# Altium project ANE_0002_02AA.PrjPCB
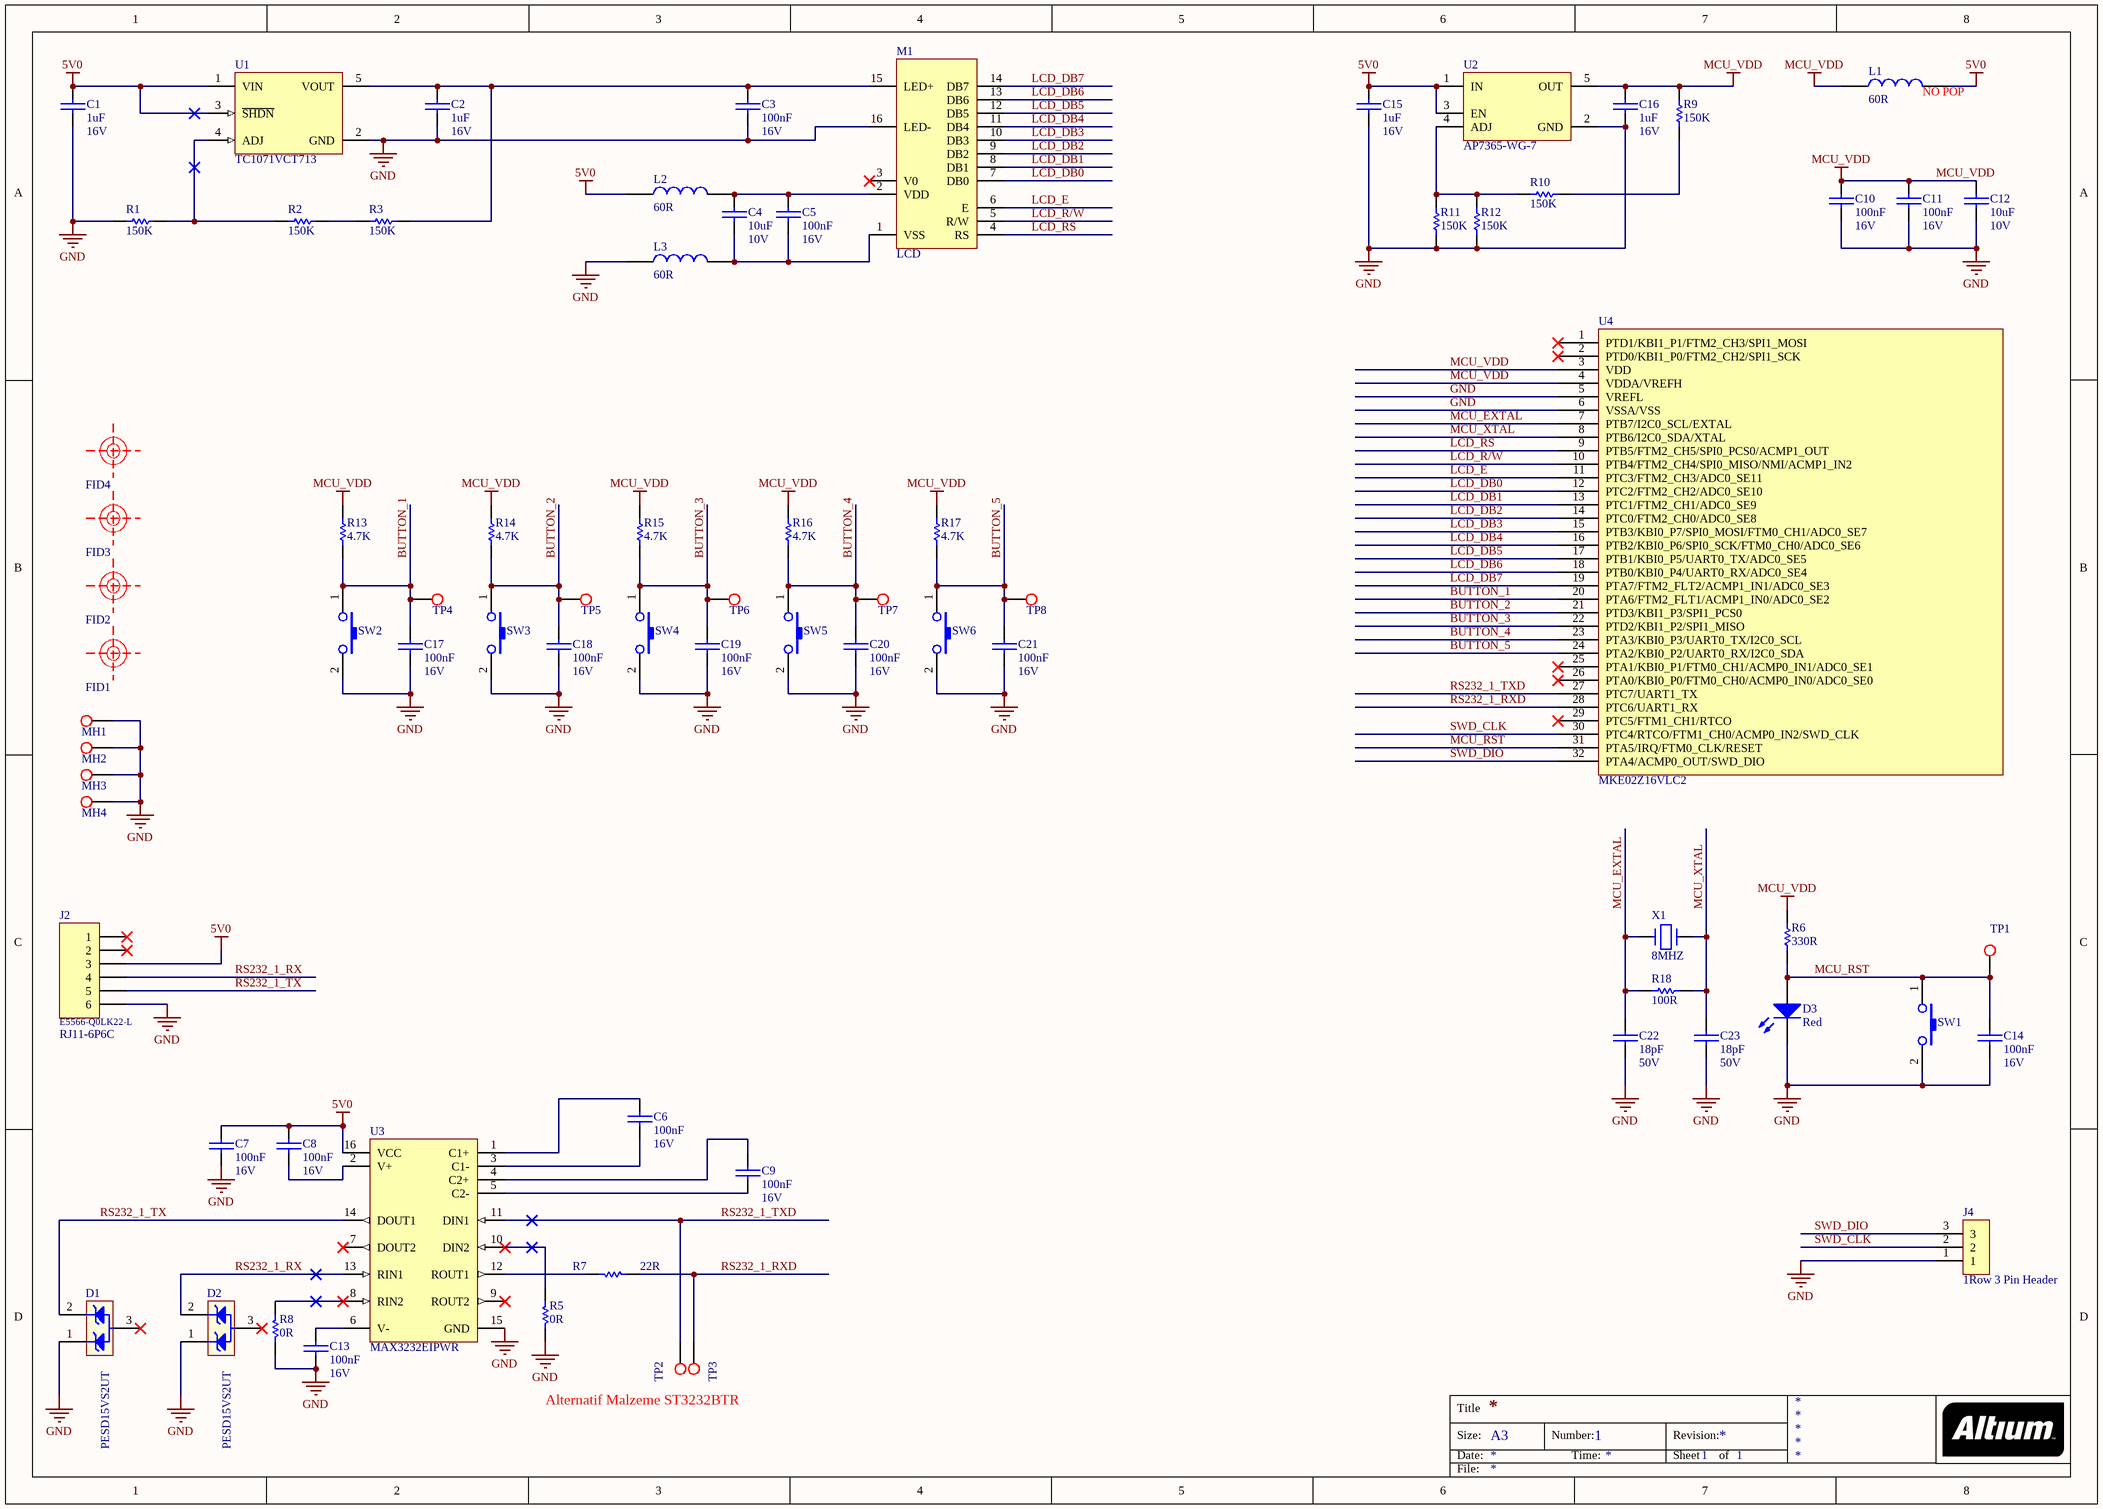
[diagram p0: Main.SchDoc]
ArtronProjeNumarasi: AB00-0006-01AC-0000; Bolum: Artron/Donaným; DegisiklikNumarasi: AC; DegistirmeTarihi: 21.01.2014; GizlilikSinifi: HÝZMETE ÖZEL; KullanilanDil: TR; OlusturmaTarihi: 08.11.2013; Ortam: Altium Designer 13.2.5; PCBDegisiklikTarihi: 20.09.2013
1 sheet, 76 parts. Net scope: hierarchical (ports join the sheet entries above them; power ports are global).
Board file: ANE_0002_02AA_0000.PcbDoc

## Sheet Main.SchDoc
size A3; DocumentNumber: 1; SheetNumber: 1; SheetTotal: 1

### Parts
C1  Operating Voltage: 16V  [CAPC2012X14N]  (hidden comment: 1uF)
C2  Operating Voltage: 16V  [CAPC2012X14N]  (hidden comment: 1uF)
C3  Operating Voltage: 16V  [CAPC1005X06N]  (hidden comment: 100nF)
C4  Operating Voltage: 10V  [CAPC2012X09N]  (hidden comment: 10uF)
C5  Operating Voltage: 16V  [CAPC1005X06N]  (hidden comment: 100nF)
C6  Operating Voltage: 16V  [CAPC1005X06N]  (hidden comment: 100nF)
C7  Operating Voltage: 16V  [CAPC1005X06N]  (hidden comment: 100nF)
C8  Operating Voltage: 16V  [CAPC1005X06N]  (hidden comment: 100nF)
C9  Operating Voltage: 16V  [CAPC1005X06N]  (hidden comment: 100nF)
C10  Operating Voltage: 16V  [CAPC1005X06N]  (hidden comment: 100nF)
C11  Operating Voltage: 16V  [CAPC1005X06N]  (hidden comment: 100nF)
C12  Operating Voltage: 10V  [CAPC2012X09N]  (hidden comment: 10uF)
C13  Operating Voltage: 16V  [CAPC1005X06N]  (hidden comment: 100nF)
C14  Operating Voltage: 16V  [CAPC1005X06N]  (hidden comment: 100nF)
C15  Operating Voltage: 16V  [CAPC2012X14N]  (hidden comment: 1uF)
C16  Operating Voltage: 16V  [CAPC2012X14N]  (hidden comment: 1uF)
C17  Operating Voltage: 16V  [CAPC1005X06N]  (hidden comment: 100nF)
C18  Operating Voltage: 16V  [CAPC1005X06N]  (hidden comment: 100nF)
C19  Operating Voltage: 16V  [CAPC1005X06N]  (hidden comment: 100nF)
C20  Operating Voltage: 16V  [CAPC1005X06N]  (hidden comment: 100nF)
C21  Operating Voltage: 16V  [CAPC1005X06N]  (hidden comment: 100nF)
C22  Operating Voltage: 50V  [CAPC1005X06N]  (hidden comment: 18pF)
C23  Operating Voltage: 50V  [CAPC1005X06N]  (hidden comment: 18pF)
D1  PESD15VS2UT  [SOT95P230X111-3N]
D2  PESD15VS2UT  [SOT95P230X111-3N]
D3  Red  [LEDSC16X08X08-2N]
FID1  Fiducial  [FIDUCIAL_R1MM0]  (value not drawn)
FID2  Fiducial  [FIDUCIAL_R1MM0]  (value not drawn)
FID3  Fiducial  [FIDUCIAL_R1MM0]  (value not drawn)
FID4  Fiducial  [FIDUCIAL_R1MM0]  (value not drawn)
J2  Manufacturer Part Number: E5566-Q0LK22-L  [AJ31-1006-TKSR-RPU0]  (hidden comment: RJ11-6P6C)
J4  1Row 3 Pin Header  [AJ23-1003-T8P0-VFC0]
L1  60R  Assembly: NO POP  [INDC2012X10N]
L2  60R  [INDC2012X10N]
L3  60R  [INDC2012X10N]
M1  LCD  [AME0_GLCD_1432_0000]
MH1  AEMT-C00S-1000-0000  [TP100]  (value not drawn)
MH2  AEMT-C00S-1000-0000  [TP100]  (value not drawn)
MH3  AEMT-C00S-1000-0000  [TP100]  (value not drawn)
MH4  AEMT-C00S-1000-0000  [TP100]  (value not drawn)
R1  150K  [RESC1005X04N]
R2  150K  [RESC1005X04N]
R3  150K  [RESC1005X04N]
R5  0R  [RESC1005X04N]
R6  330R  [RESC1005X04N]
R7  22R  [RESC1005X04N]
R8  0R  [RESC1005X04N]
R9  150K  [RESC1005X04N]
R10  150K  [RESC1005X04N]
R11  150K  [RESC1005X04N]
R12  150K  [RESC1005X04N]
R13  4.7K  [RESC1005X04N]
R14  4.7K  [RESC1005X04N]
R15  4.7K  [RESC1005X04N]
R16  4.7K  [RESC1005X04N]
R17  4.7K  [RESC1005X04N]
R18  100R  [RESC1005X04N]
SW1  Push Button  [AE22-010S-0000-0000]  (value not drawn)
SW2  Push Button  [AE22-010S-0000-0000]  (value not drawn)
SW3  Push Button  [AE22-010S-0000-0000]  (value not drawn)
SW4  Push Button  [AE22-010S-0000-0000]  (value not drawn)
SW5  Push Button  [AE22-010S-0000-0000]  (value not drawn)
SW6  Push Button  [AE22-010S-0000-0000]  (value not drawn)
TP1  AEMT-C00S-1000-0000  [TP100]  (value not drawn)
TP2  AEMT-C00S-1000-0000  [TP100]  (value not drawn)
TP3  AEMT-C00S-1000-0000  [TP100]  (value not drawn)
TP4  AEMT-C00S-1000-0000  [TP100]  (value not drawn)
TP5  AEMT-C00S-1000-0000  [TP100]  (value not drawn)
TP6  AEMT-C00S-1000-0000  [TP100]  (value not drawn)
TP7  AEMT-C00S-1000-0000  [TP100]  (value not drawn)
TP8  AEMT-C00S-1000-0000  [TP100]  (value not drawn)
U1  TC1071VCT713  [SOT-23-CT5_N]
U2  AP7365-WG-7  [SOT95P285X110-5N]
U3  MAX3232EIPWR  [TSOP65P640X120-16N]
U4  MKE02Z16VLC2  [TQFP80P900X900X160-32N]
X1  8MHZ  [XTAL50X32X13]

### Nets
5V0: C1.2 C7.2 C8.2 C15.2 J2.3 L1.2 L2.1 U1.1(VIN) U1.3(~{SHDN}) U2.1(IN) U2.3(EN) U3.16(VCC)
GND: C1.1 C2.1 C3.1 C7.1 C10.1 C11.1 C12.1 C13.1 C14.1 C15.1 C16.1 C17.1 C18.1 C19.1 C20.1 C21.1 C22.2 C23.2 D1.1 D2.1 D3.1(K) J2.6 J4.1 L3.1 M1.16(LED-) MH1.1 MH2.1 MH3.1 MH4.1 R1.2 R5.2 R8.2 R11.1 R12.1 SW1.2 SW2.2 SW3.2 SW4.2 SW5.2 SW6.2 U1.2(GND) U2.2(GND) U3.15(GND) U4.5(VREFL) U4.6(VSSA/VSS)
MCU_VDD: C10.2 C11.2 C12.2 C16.2 L1.1 R6.2 R9.1 R13.2 R14.2 R15.2 R16.2 R17.2 U2.5(OUT) U4.3(VDD) U4.4(VDDA/VREFH)
BUTTON_1: C17.2 R13.1 SW2.1 TP4.1 U4.20(PTA6/FTM2_FLT1/ACMP1_IN0/ADC0_SE2)
BUTTON_2: C18.2 R14.1 SW3.1 TP5.1 U4.21(PTD3/KBI1_P3/SPI1_PCS0)
BUTTON_3: C19.2 R15.1 SW4.1 TP6.1 U4.22(PTD2/KBI1_P2/SPI1_MISO)
BUTTON_4: C20.2 R16.1 SW5.1 TP7.1 U4.23(PTA3/KBI0_P3/UART0_TX/I2C0_SCL)
BUTTON_5: C21.2 R17.1 SW6.1 TP8.1 U4.24(PTA2/KBI0_P2/UART0_RX/I2C0_SDA)
LCD_DB0: M1.7(DB0) U4.12(PTC2/FTM2_CH2/ADC0_SE10)
LCD_DB1: M1.8(DB1) U4.13(PTC1/FTM2_CH1/ADC0_SE9)
LCD_DB2: M1.9(DB2) U4.14(PTC0/FTM2_CH0/ADC0_SE8)
LCD_DB3: M1.10(DB3) U4.15(PTB3/KBI0_P7/SPI0_MOSI/FTM0_CH1/ADC0_SE7)
LCD_DB4: M1.11(DB4) U4.16(PTB2/KBI0_P6/SPI0_SCK/FTM0_CH0/ADC0_SE6)
LCD_DB5: M1.12(DB5) U4.17(PTB1/KBI0_P5/UART0_TX/ADC0_SE5)
LCD_DB6: M1.13(DB6) U4.18(PTB0/KBI0_P4/UART0_RX/ADC0_SE4)
LCD_DB7: M1.14(DB7) U4.19(PTA7/FTM2_FLT2/ACMP1_IN1/ADC0_SE3)
LCD_E: M1.6(E) U4.11(PTC3/FTM2_CH3/ADC0_SE11)
LCD_R/W: M1.5(R/W) U4.10(PTB4/FTM2_CH4/SPI0_MISO/NMI/ACMP1_IN2)
LCD_RS: M1.4(RS) U4.9(PTB5/FTM2_CH5/SPI0_PCS0/ACMP1_OUT)
MCU_EXTAL: C22.1 R18.1 U4.7(PTB7/I2C0_SCL/EXTAL) X1.1
MCU_RST: C14.2 D3.2(A) R6.1 SW1.1 TP1.1 U4.31(PTA5/IRQ/FTM0_CLK/RESET)
MCU_XTAL: C23.1 R18.2 U4.8(PTB6/I2C0_SDA/XTAL) X1.2
RS232_1_RX: D2.2 J2.4 U3.13(RIN1)
RS232_1_RXD: R7.1 TP3.1 U4.28(PTC6/UART1_RX)
RS232_1_TX: D1.2 J2.5 U3.14(DOUT1)
RS232_1_TXD: TP2.1 U3.11(DIN1) U4.27(PTC7/UART1_TX)
SWD_CLK: J4.2 U4.30(PTC4/RTCO/FTM1_CH0/ACMP0_IN2/SWD_CLK)
SWD_DIO: J4.3 U4.32(PTA4/ACMP0_OUT/SWD_DIO)
NetC2_2: C2.2 C3.2 M1.15(LED+) R3.1 U1.5(VOUT)
NetC4_1: C4.1 C5.1 L3.2 M1.1(VSS)
NetC4_2: C4.2 C5.2 L2.2 M1.2(VDD)
NetC6_1: C6.1 U3.3(C1-)
NetC6_2: C6.2 U3.1(C1+)
NetC8_1: C8.1 U3.2(V+)
NetC9_1: C9.1 U3.5(C2-)
NetC9_2: C9.2 U3.4(C2+)
NetC13_2: C13.2 U3.6(V-)
NetR1_1: R1.1 R2.2 U1.4(ADJ)
NetR2_1: R2.1 R3.2
NetR5_1: R5.1 U3.10(DIN2)
NetR7_2: R7.2 U3.12(ROUT1)
NetR8_1: R8.1 U3.8(RIN2)
NetR9_2: R9.2 R10.2
NetR10_1: R10.1 R11.2 R12.2 U2.4(ADJ)

Not connected (* = marked no-connect by the designer): D1 3*; D2 3*; J2 1* 2*; M1 3(V0)*; U3 7(DOUT2)* 9(ROUT2)*; U4 1(PTD1/KBI1_P1/FTM2_CH3/SPI1_MOSI)* 2(PTD0/KBI1_P0/FTM2_CH2/SPI1_SCK)* 25(PTA1/KBI0_P1/FTM0_CH1/ACMP0_IN1/ADC0_SE1)* 26(PTA0/KBI0_P0/FTM0_CH0/ACMP0_IN0/ADC0_SE0)* 29(PTC5/FTM1_CH1/RTCO)*

### Notes on the sheet
- Alternatif Malzeme ST3232BTR
- Title
- Size:
- Date:
- A3
- Number:
- Time:
- Revision:
- Sheet
- of
- File:

### Library data of the parts
C1 C2 C15 C16 = ACC7-3100-S441-0000: CAP, CER, X7R, 1uF, %10, 16V, 0805; Manufacturer: Murata; Manufacturer Part Number: GRM21BR71C105KA01L; CR: 000049; Requested by: MU; Lead Finish: Pb Free; Material: Ceramic, X7R; Definition Date: 14.08.2012; Revision Date: *; Price: *; Supplier: *; Supplier Part Number: *; DS: 000049; Operating Temp: -55 to 125 C; Storage Temp: -55 to 125 C; Status: Active; Package Reference: EIA 0805, Metric 2012; Component Type: Capacitor; Footprint Type: SMD; Published by: MU; ESR: *; FR: *; Value: 1uF
C3 C5-C11 C13 C14 C17-C21 = ACC7-2100-S241-0000: CAP, CER, X7R, 100nF, %10, 16V, 0402; Manufacturer: Murata; Manufacturer Part Number: GRM155R71C104KA88D; CR: 000049; Requested by: MU; Lead Finish: Pb Free; Material: Ceramic, X7R; Definition Date: 14.08.2012; Revision Date: *; Price: *; Supplier: *; Supplier Part Number: *; DS: 000049; Operating Temp: -55 to 125 C; Storage Temp: -55 to 125 C; Status: Active; Package Reference: EIA 0402, Metric 1005; Component Type: Capacitor; Footprint Type: SMD; Published by: MU; ESR: *; FR: *; Value: 100nF
C4 C12 = ACC7-4100-S431-0000: CAP, CER, X7R, 10uF, %10, 10V, 0805; Manufacturer: Murata; Manufacturer Part Number: GRM21BR71A106KE51L; CR: 000049; Requested by: MAY; Lead Finish: Pb Free; Published by: MU; Material: Ceramic, X7R; Definition Date: 22.10.2012; Revision Date: *; Price: *; Supplier: *; Supplier Part Number: *; DS: 000049; Operating Temp: -55 to 125 C; Storage Temp: -55 to 125 C; Status: Active; Package Reference: EIA 0805, Metric 2012; Component Type: Capacitor; Footprint Type: SMD; ESR: *; FR: *; Value: 10uF
C22 C23 = ACC0-Y180-S272-0000: CAP, CER, C0G, 18pF, %5, 50V, 0402; Manufacturer: Murata; Manufacturer Part Number: GRM1555C1H180JA01D; CR: 000049; Requested by: MU; Lead Finish: Pb Free; Material: Ceramic, C0G; Definition Date: 14.08.2012; Revision Date: *; Price: *; Supplier: *; Supplier Part Number: *; DS: 000049; Operating Temp: -55 to 125 C; Storage Temp: -55 to 125 C; Status: Active; Package Reference: EIA 0402, Metric 1005; Component Type: Capacitor; Footprint Type: SMD; Published by: MU; ESR: *; FR: *; Value: 18pF
D1 D2 = AS1H-950M-SI20-0000: Diode, TVS, ESD Protection, 15V, PESD15VS2UT, SOT-23; Manufacturer: NXP; CR: 451; DS: 000452; Lead Finish: Pb Free; Published by: MU; Requested by: NK; Price: *; Manufacturer Part Number: PESD15VS2UT; Definition Date: 11.12.2014; Footprint Type: SMD; JEDEC Code: *; Operating Temp: -65°C to 150°C; Package Reference: SOT-23; Revision Date: *; Status: Active; Storage Temp: -65°C to 150°C; Supplier: *; Supplier Part Number: *; Component Type: DIODE; Forward Voltage: *; Reverse Voltage: 15V; Value: PESD15VS2UT
D3 = AS42-730L-SC50-0000: LED, Red, 627 nm, 15 mcd, 120 degree, 2V, SMD, 0603; Manufacturer Part Number: APT1608EC; Manufacturer: Kingbright; CR: 000172; Lead Finish: Pb Free; Published by: MU; Requested by: OO; Price: *; DS: 000172; Definition Date: 17.12.2012; Footprint Type: SMD; JEDEC Code: *; Operating Temp: -40°C To +85°C; Package Reference: EIA 0603, Metric 1608; Revision Date: *; Status: Active; Storage Temp: -40°C To +85°C; Supplier: *; Supplier Part Number: *; Component Type: LED; Forward Voltage: 2V; Value: Red
FID1-FID4 = FIDUCIAL_R1MM0: Fiducial, Round, 1mm; Published By: MAY; Definition Date: 24.05.2012; Height: 0; Revision: 0; Component Type: Fiducial
J2 = AJ31-1006-TKSR-RPU0: CON, Jack, 6P6C, 1 Row, 6 Pins, 1.02 mm, TH, S, RA; Manufacturer: Pulse; Requested by: NK; Lead Finish: Pb Free; Max. Operating Voltage: 125V; Rated Current: 1.5A; CR: -; Definition Date: 11.08.2015; Revision Date: *; Price: *; Supplier: *; Supplier Part Number: *; DS: -; Operating Temp: -40°C to +85°C; Storage Temp: -40°C to +105°C; Status: Active; Package Reference: *; Component Type: Connector; Footprint Type: SMD; Published by: NK; JEDEC Code: *; Material: *; Value: RJ11-6P6C
J4 = AJ23-1003-T8P0-VFC0: CON, W2B, 3 Pins, 1-Row, 2.54mm, TH, P, VER; Manufacturer: FCI; Manufacturer Part Number: 68001-203HLF; CR: 000184; Requested by: NK; Lead Finish: Pb Free; Published by: MU; Definition Date: 30.01.2013; Revision Date: *; Price: *; Supplier: *; Supplier Part Number: *; DS: 000184; Operating Temp: *; Storage Temp: *; Status: Active; Package Reference: *; Component Type: Connector; Footprint Type: TH; JEDEC Code: *; Material: *; Max. Operating Voltage: *; Rated Current: *; Value: 1Row 3 Pin Header
L1-L3 = AL5F-1600-S236-3350: Inductor, Ferrite Bead, 3.5A, 60 Ohm, SMD; Manufacturer: Murata; Manufacturer Part Number: BLM21PG600SN1D; CR: 000057; DCR(max): 20mR; Lead Finish: Pb Free; Published By: MU; Impedance: 60ohm @100Mhz; Value: 10uH; Price: *; DS: 000057; Component Type: Ferrite Bead; Definition Date: 24.08.2012; Footprint Type: SMD; Height: 1.05mm; JEDEC Code: *; Operating Temp: -55 to 125°C; Package Reference: *; Rated Current: 3.5A; Requested By: MU; Revision Date: *; Status: Acitve; Storage Temp: -55 to 125°C; Supplier: *; Supplier Part Number: *
M1 = AME0_GLCD_1432_0000: Module, LCD, Graph, 144x32, FSTN+ 5V0; Manufacturer Part Number: NHD‐14432WG‐BTFH‐V#T; Manufacturer: Newhaven Display
MH1-MH4 TP1-TP8 = AEMT-C00S-1000-0000: Test Point, Circular, 1mm; Text: TEST_POINT
R1-R3 R9-R12 = AR19-5150-S2B2-0000: RES, E24, Thick Film, SMD, 150K, 1%, 0.1W, 0402; Manufacturer: Panasonic; Manufacturer Part Number: ERJ-2RKF1503X; CR: DS00073; Requested by: MU; Lead Finish: Pb Free; Max. Operating Voltage: 50V; Definition Date: 16.08.2012; Revision Date: *; Price: *; Supplier: *; Supplier Part Number: *; DS: DS00073; Operating Temp: -55 to 155 C; Storage Temp: -55 to 155 C; Status: Active; Package Reference: EIA 0402, Metric 1005; Component Type: Resistor; Footprint Type: SMD; Published by: MU; JEDEC Code: *; Material: Thick Film; ESR: *; FR: *; Power Rating: 0.1W; Value: 150K
R5 R8 = AR19-0000-S201-0000: RES, Thick Film, SMD, 0R, Jumper, 0.1W, 0402; Manufacturer: Panasonic; Manufacturer Part Number: ERJ-2GE0R00X; CR: 000062; Requested by: MAY; Lead Finish: Pb Free; Published by: MU; Max. Operating Voltage: 50V; Definition Date: 09.07.2012; Revision Date: *; Price: *; Supplier: *; Supplier Part Number: *; DS: 000062; Operating Temp: -55 to 155 C; Storage Temp: -55 to 155 C; Status: Active; Package Reference: EIA 0402, Metric 1005; Component Type: Resistor; Footprint Type: SMD; JEDEC Code: *; Material: Thick Film; ESR: *; FR: *; Power Rating: 0.1W; Value: 0R
R6 = AR19-2330-S2B2-0000: RES, E24, Thick Film, SMD, 330R, 1%, 0.1W, 0402; Manufacturer: Panasonic; Manufacturer Part Number: ERJ-2RKF3300X; CR: DS00073; Requested by: MU; Lead Finish: Pb Free; Max. Operating Voltage: 50V; Definition Date: 16.08.2012; Revision Date: *; Price: *; Supplier: *; Supplier Part Number: *; DS: DS00073; Operating Temp: -55 to 155 C; Storage Temp: -55 to 155 C; Status: Active; Package Reference: EIA 0402, Metric 1005; Component Type: Resistor; Footprint Type: SMD; Published by: MU; JEDEC Code: *; Material: Thick Film; ESR: *; FR: *; Power Rating: 0.1W; Value: 330R
R7 = AR19-1220-S2B2-0000: RES, E24, Thick Film, SMD, 22R, 1%, 0.1W, 0402; Manufacturer: Panasonic; Manufacturer Part Number: ERJ-2RKF22R0X; CR: DS00073; Requested by: MU; Lead Finish: Pb Free; Max. Operating Voltage: 50V; Definition Date: 16.08.2012; Revision Date: *; Price: *; Supplier: *; Supplier Part Number: *; DS: DS00073; Operating Temp: -55 to 155 C; Storage Temp: -55 to 155 C; Status: Active; Package Reference: EIA 0402, Metric 1005; Component Type: Resistor; Footprint Type: SMD; Published by: MU; JEDEC Code: *; Material: Thick Film; ESR: *; FR: *; Power Rating: 0.1W; Value: 22R
R13-R17 = AR19-3470-S2B2-0000: RES, E24, Thick Film, SMD, 4.7K, 1%, 0.1W, 0402; Manufacturer: Panasonic; Manufacturer Part Number: ERJ-2RKF4701X; CR: DS00073; Requested by: MU; Lead Finish: Pb Free; Max. Operating Voltage: 50V; Definition Date: 16.08.2012; Revision Date: *; Price: *; Supplier: *; Supplier Part Number: *; DS: DS00073; Operating Temp: -55 to 155 C; Storage Temp: -55 to 155 C; Status: Active; Package Reference: EIA 0402, Metric 1005; Component Type: Resistor; Footprint Type: SMD; Published by: MU; JEDEC Code: *; Material: Thick Film; ESR: *; FR: *; Power Rating: 0.1W; Value: 4.7K
R18 = AR19-2100-S2B2-0000: RES, E24, Thick Film, SMD, 100R, 1%, 0.1W, 0402; Manufacturer: Panasonic; Manufacturer Part Number: ERJ-2RKF1000X; CR: DS00073; Requested by: MU; Lead Finish: Pb Free; Max. Operating Voltage: 50V; Definition Date: 16.08.2012; Revision Date: *; Price: *; Supplier: *; Supplier Part Number: *; DS: DS00073; Operating Temp: -55 to 155 C; Storage Temp: -55 to 155 C; Status: Active; Package Reference: EIA 0402, Metric 1005; Component Type: Resistor; Footprint Type: SMD; Published by: MU; JEDEC Code: *; Material: Thick Film; ESR: *; FR: *; Power Rating: 0.1W; Value: 100R
SW1-SW6 = AE22-010S-0000-0000: Switch, Push, SMD 6.6x6.0mm, Trip Force 350g; Manufacturer: Panasonic; Manufacturer Part Number: EVQ-Q2203W; CR: 00183/63; DS: 00183; Published By: MU; Requested By: NK; Current Rating: 20mA; Max. Operating Voltage: 15V; Definition Date: 25.01.2013; Height: 3.1mm; Operating Temp: -40 °C to +85 °C; Footprint Type: SMD; Revision: *; Revision Date: *; Lead Finish: *; Status: Active; Storage Temp: -40 °C to +85 °C; Component Type: Switch; JEDEC Code: *; Package Reference: SMD 6.6x6.0mm; Price: *; Supplier: *; Supplier Part Number: *; Value: Push Button
U1 = TC1071VCT713: 50mA, 100mA and 150mA Adjustable CMOS LDOs with Shutdown, 5-Pin SOT-23, Extended Temperature, Tape and Reel; Manufacturer: Microchip; DatasheetVersion: revD, Mar-2007; PackageVersion: revBB, Aug-2009; PackageReference: SOT-23-CT5; PackageDescription: 5-Lead Plastic Small Outline Transistor (CT) [SOT-23]; Supplier 1: Digi-Key; Supplier Part Number 1: TC1071VCT713TR-ND; Supplier 2: Digi-Key; Supplier Part Number 2: TC1071VCT713CT-ND; Supplier 3: Digi-Key; Supplier Part Number 3: TC1071VCT713DKR-ND; Supplier 4: Newark; Supplier Part Number 4: 92C5592; Supplier 5: Mouser; Supplier Part Number 5: 579-TC1071VCT713; Mounting Technology: Surface Mount; Code_IPC: SOT23-5; PartNumber: TC1071VCT713; ComponentLink1Description: Manufacturer URL; ComponentLink1URL: http://www.microchip.com/; ComponentLink2Description: Datasheet; ComponentLink2URL: http://ww1.microchip.com/downloads/en/DeviceDoc/21353d.pdf; ComponentLink3Description: Package Specification; ComponentLink3URL: http://www.microchip.com/stellent/groups/techpub_sg/documents/packagingspec/en012702.pdf
U2 = AT8T-0000-SM90-1843: IC, PMIC, LDO, 2-6V In, Adj Vout, 600 mA LDO, AP7365-WG-7, SOT-25-5; Manufacturer: Diodes Incorporated; Lead Finish: Pb Free; Requested by: NK; DS: -; Price: -; CR: -; Definition Date: 11.10.2015; Component Type: IC; Footprint Type: SMD; JEDEC Code: *; Operating Temp: -40 to 85 C; Package Reference: SOT-25-5; Published by: -; Revision Date: 11.10.2015; Status: Active; Storage Temp: -65 to +150; Supplier: *; Supplier Part Number: *; Manufacturer Part Number: AP7365-WG-7; FR: *; Revision By: NK; Value: AP7365-WG-7
U3 = AT41-0000-SM90-0540: IC, Interface, RS232 Driver, MAX3232EIPWR, TSSOP-16; Manufacturer: Texas Instruments; Manufacturer Part Number: MAX3232EIPWRQ1; CR: 000008; Requested by: MAY; Lead Finish: Pb Free; Published by: OO; JEDEC Code: MO-187 AA; Definition Date: 18.04.2012; Price: 1.8; Supplier: *; Supplier Part Number: *; DS: 000008; Operating Temp: -40 to 85 C; Revision Date: 12.11.2012; Status: Active; Storage Temp: -65 to 150 C; Component Type: IC; Package Reference: TSSOP-16; Footprint Type: SMD; FR: *; Value: MAX3232EIPWR
U4 = AT35-0000-SF80-1842: IC, Embedded, Microcontroller, MKE02Z16VLC2, LQFP32; Manufacturer: Freescale; Published by: NK; Component Type: IC; CR: -; Definition Date: 11.10.2015; DS: -; Footprint Type: SMD; JEDEC Code: -; Lead Finish: -; Manufacturer Part Number: MKE02Z16VLC2; Operating Temp: -40, +105; Package Reference: LQFP32; Requested by: NK; Status: Active; FR: -
X1 = AX20-6800-S000-0000: Crystal, Fund, 8 MHZ, 20ppm, 18pF, SMD; Manufacturer: Abracon; Manufacturer Part Number: ABM3-8.000MHZ-D2Y-T; CR: 000080; Lead Finish: Pb Free; Published by: MU; Frequency Stability: 30ppm; Component Type: CRYSTAL; Definition Date: 28.08.2012; DS: 000080; Footprint Type: SMD; JEDEC Code: *; Operating Temp: -40 to 85 C; Requested by: MU; Revision Date: 04.09.2012; Status: Active; Storage Temp: -40 to 90 C; Supplier: *; Supplier Part Number: *; FR: *; Tolerance: 20ppm; Load Capacitance: 18pF; Value: 8MHZ

## Assembly variants
AB00 0006 01AC 0000: all parts fitted
AB00 0006 01AC 0001: not fitted C406 C506 C1115 C2604 C2605 C2606 C2607 C2700_1 C2700_2 C2700_3 C2700_4 C2701_1 C2701_2 C2701_3 C2701_4 C2702_1 C2702_2 C2702_3 C2702_4 C2703_1 C2703_2 C2703_3 C2703_4 C2704_1 C2704_2 C2704_3 C2704_4 D1105 D2701_1 D2701_2 D2701_3 D2701_4 J1801 L1000 L2700_1 L2700_2 L2700_3 L2700_4 Q2102 R515 R803 R812 R813 R814 R831 R834 R835 R1000 R1001 R1002 R1003 R1005 R1006 R1007 R1008 R1009 R1017 R1018 R1019 R1025 R1026 R1027 R1028 R1035 R1036 R1037 R1108_1 R1108_2 R1116 R1117 R1118 R1119 R1120 R1121 R1123 R1124 R1129 R1130 R1132 R1203_1 R1203_2 R1203_3 R1303_1 R1303_2 R1303_3 R1303_4 R1311 R1312 R1405_1 R1405_2 R1406_1 R1406_2 R1702 R1803 R2109 R2403_1 R2403_2 R2403_3 R2403_4 R2406_1 R2406_2 R2406_3 R2406_4 R2607 R2609 R2623 R2624 R2700_1 R2700_2 R2700_3 R2700_4 R2701_1 R2701_2 R2701_3 R2701_4 R2702_1 R2702_2 R2702_3 R2702_4 R2703_1 R2703_2 R2703_3 R2703_4 R2704_1 R2704_2 R2704_3 R2704_4 R2800 R2801 R2802 R2803 R2804 R2805 R2806 R2807 U1000 U1001 U1104 U2700_1 U2700_2 U2700_3 U2700_4 U2701_1 U2701_2 U2701_3 U2701_4